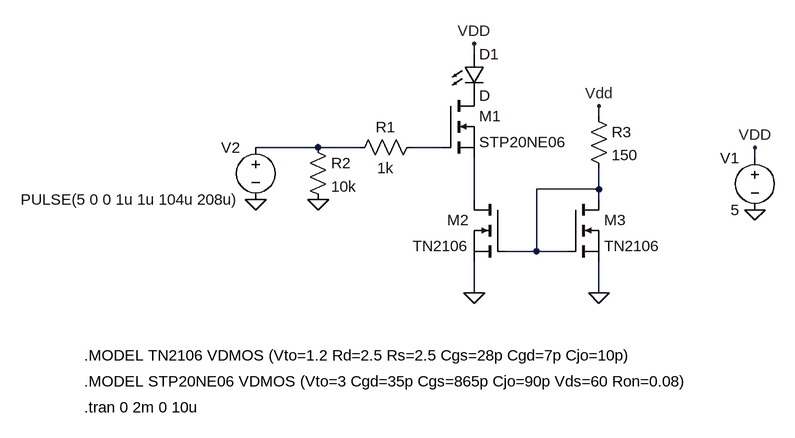
[diagram p0: schematic ProjectTxPulse.asc]
ProjectTxPulse.asc, the LTspice schematic file:
Version 4.1
SHEET 1 2028 680
WIRE 400 -80 400 -96
WIRE 592 16 592 0
WIRE 160 64 64 64
WIRE 224 64 160 64
WIRE 352 64 304 64
WIRE 832 80 832 64
WIRE 592 128 592 96
WIRE 592 128 496 128
WIRE 400 144 400 80
WIRE 592 144 592 128
WIRE 496 224 496 128
WIRE 496 224 448 224
WIRE 544 224 496 224
WIRE 400 288 400 240
WIRE 592 288 592 240
FLAG 832 160 0
FLAG 160 144 0
FLAG 832 64 VDD
FLAG 400 -96 VDD
FLAG 64 144 0
FLAG 592 0 Vdd
FLAG 400 288 0
FLAG 592 288 0
SYMBOL voltage 832 64 M0
WINDOW 123 0 0 Left 0
WINDOW 39 0 0 Left 0
SYMATTR InstName V1
SYMATTR Value 5
SYMBOL nmos 352 -16 R0
SYMATTR InstName M1
SYMATTR Value STP20NE06
SYMBOL res 144 48 R0
SYMATTR InstName R2
SYMATTR Value 10k
SYMBOL voltage 64 48 M0
WINDOW 123 0 0 Left 0
WINDOW 39 0 0 Left 0
SYMATTR InstName V2
SYMATTR Value PULSE(5 0 0 1u 1u 104u 208u)
SYMBOL LED 384 -80 R0
SYMATTR InstName D1
SYMBOL nmos 448 144 M0
SYMATTR InstName M2
SYMATTR Value TN2106
SYMBOL nmos 544 144 R0
SYMATTR InstName M3
SYMATTR Value TN2106
SYMBOL res 576 0 R0
SYMATTR InstName R3
SYMATTR Value 150
SYMBOL res 320 48 R90
WINDOW 0 0 56 VBottom 2
WINDOW 3 32 56 VTop 2
SYMATTR InstName R1
SYMATTR Value 1k
TEXT -200 424 Left 2 !.MODEL STP20NE06 VDMOS (Vto=3 Cgd=35p Cgs=865p Cjo=90p Vds=60 Ron=0.08)
TEXT -200 464 Left 2 !.tran 0 2m 0 10u
TEXT -200 384 Left 2 !.MODEL TN2106 VDMOS (Vto=1.2 Rd=2.5 Rs=2.5 Cgs=28p Cgd=7p Cjo=10p)

The netlist it stands for:
* ProjectTxPulse.asc
V1 VDD 0 5
M1 P001 N002 N004 N004 STP20NE06
R2 N001 0 10k
V2 N001 0 PULSE(5 0 0 1u 1u 104u 208u)
D1 VDD P001 D
M2 N004 N003 0 0 TN2106
M3 N003 N003 0 0 TN2106
R3 VDD N003 150
R1 N002 N001 1k
.model D D
.lib standard.dio
.model NMOS NMOS
.model PMOS PMOS
.lib standard.mos
.MODEL STP20NE06 VDMOS (Vto=3 Cgd=35p Cgs=865p Cjo=90p Vds=60 Ron=0.08)
.tran 0 2m 0 10u
.MODEL TN2106 VDMOS (Vto=1.2 Rd=2.5 Rs=2.5 Cgs=28p Cgd=7p Cjo=10p)
.backanno
.end